# Altium schematic sheet pca10036_sheet0_cover.SchDoc: PCA10036 - Cover
size A3; Revision: 1.1.0; SheetNumber: 0; SheetTotal: 5; DrawnBy: KJP; ProjectNumber: 4397; DocumentSize: A3; PCBRevision: 0068KJP; PCAName: PCA10036; PCBNumber: 400118; ProjectName: Quark
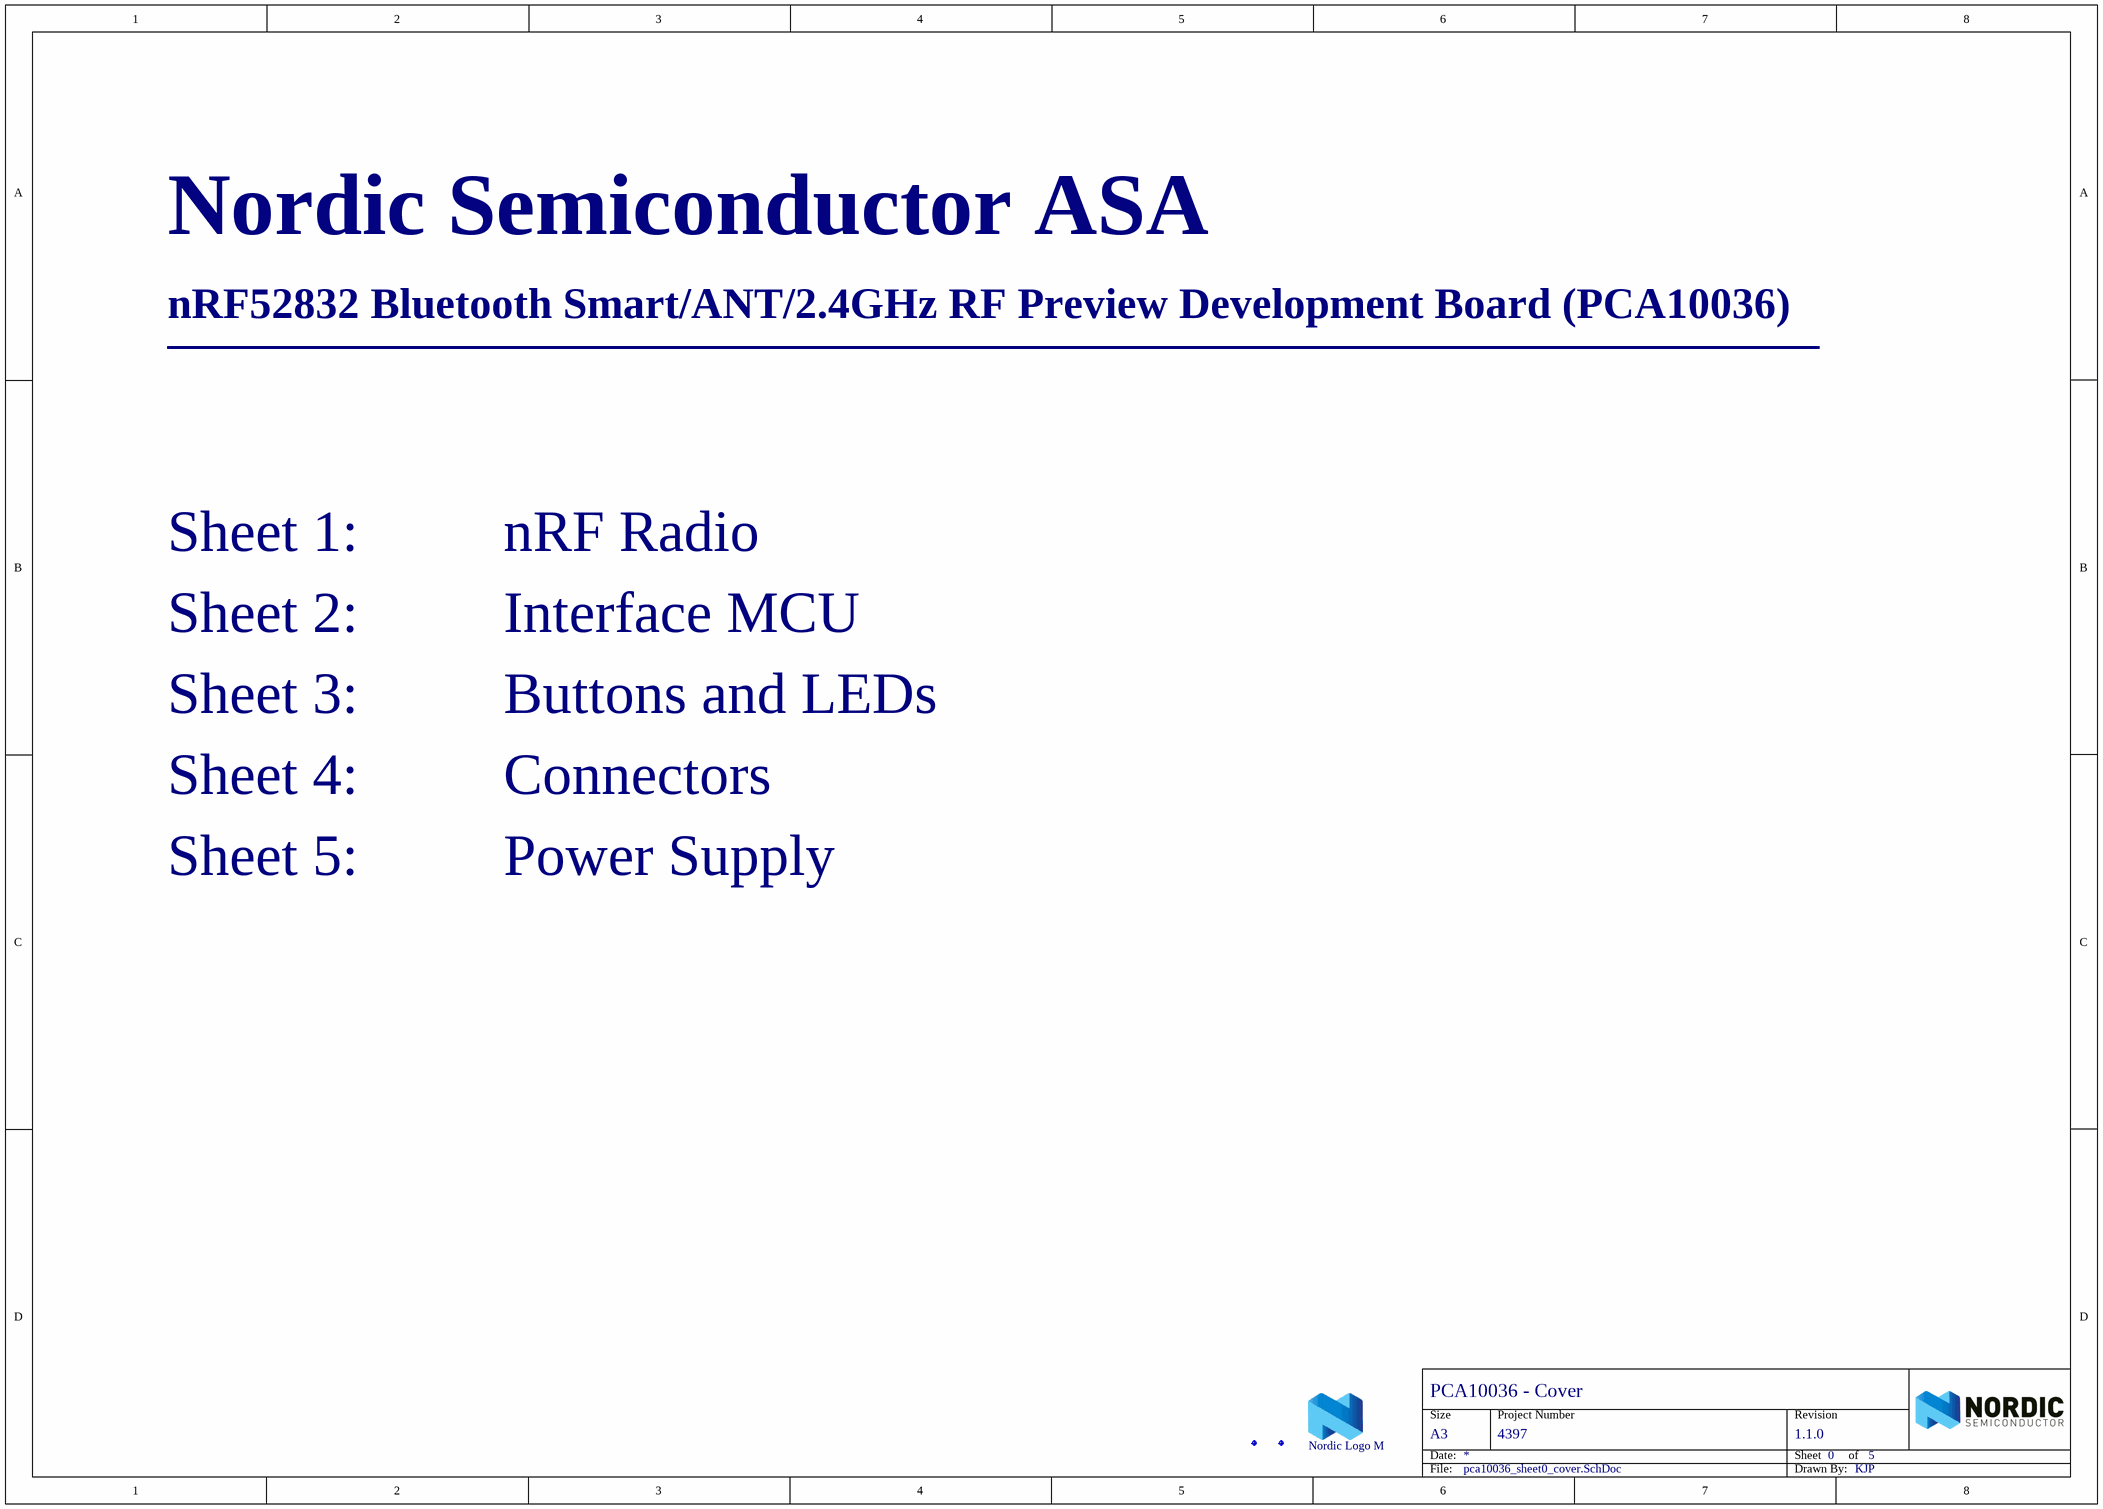
[diagram p0: pca10036_sheet0_cover.SchDoc]

## Parts
Fid1  Fiducial mark  [Fiducial]  (value not drawn)
Fid2  Fiducial mark  [Fiducial]  (value not drawn)
LOGO1  Nordic Logo M  [NORDIC_LOGO_M]  (no BOM)

## Notes on the sheet
- Nordic Semiconductor ASA
- nRF52832 Bluetooth Smart/ANT/2.4GHz RF Preview Development Board (PCA10036)
- ________________________________________________________
- Sheet 1:          nRF Radio
- Sheet 2:          Interface MCU
- Sheet 3:          Buttons and LEDs
- Sheet 4:          Connectors
- Sheet 5:          Power Supply
- Size
- Date:
- Project Number
- Sheet         of
- Revision
- File:
- Drawn By:

## Library data of the parts
Fid1 Fid2 = Fid-Mark: Artikkelnr Noca: N.A.; Part Number: Fid-Mark; Manufacturer: *; Manufacturer Part Number: *; Datasheet: *; LatestRevisionDate: 2009-12-12; Pin Count: 1; Publisher: Nordic Semiconductor; Published: 2009-12-12; Value: *; Note: *; Supplier: *; Supplier part number: *; 2nd source Supplier: *; 2nd source part number: *; Footprint Doc: Fiducial; Artikkelnr Simpro: N.A.
LOGO1 = Nordic Logo M: Nordic Logo, medium size; Artikkelnr Noca: N.A.; Part Number: Nordic Logo M; Manufacturer: *; Manufacturer Part Number: *; Datasheet: *; LatestRevisionDate: 2010-02-18; Publisher: Nordic Semiconductor; Value: Nordic Logo M; Note: *; Supplier: *; Supplier part number: *; 2nd source Supplier: *; 2nd source part number: *; Pin Count: 2; Published: 2010-02-18; Footprint Doc: NORDIC_LOGO_M; Artikkelnr Simpro: N.A.